# Altium schematic sheet Bank_13_15.SchDoc: Kasli-DIOT
size 420 x 297 mm; EDA_Number: ARTIQ; Projet: ARTIQ/SINARA; Author: G.Kasprowicz; CompanyName: WUT ISE; DrawnBy: F.Świtakowski; Organization: WUT ISE; Address1: PW ISE; Address2: Nowowiejska 15/19 00-665 Warsaw; Address3: gkasprow@gmail.com; DocumentNumber: 13; SheetNumber: 16; SheetTotal: 16; ModifiedBy: -; CheckedDate: -; Title2: Bank 13 15; DivGrp: WUT ISE; Designer: F.Świtakowski; ModifiedDate: -; ProjectName: Sensor Box
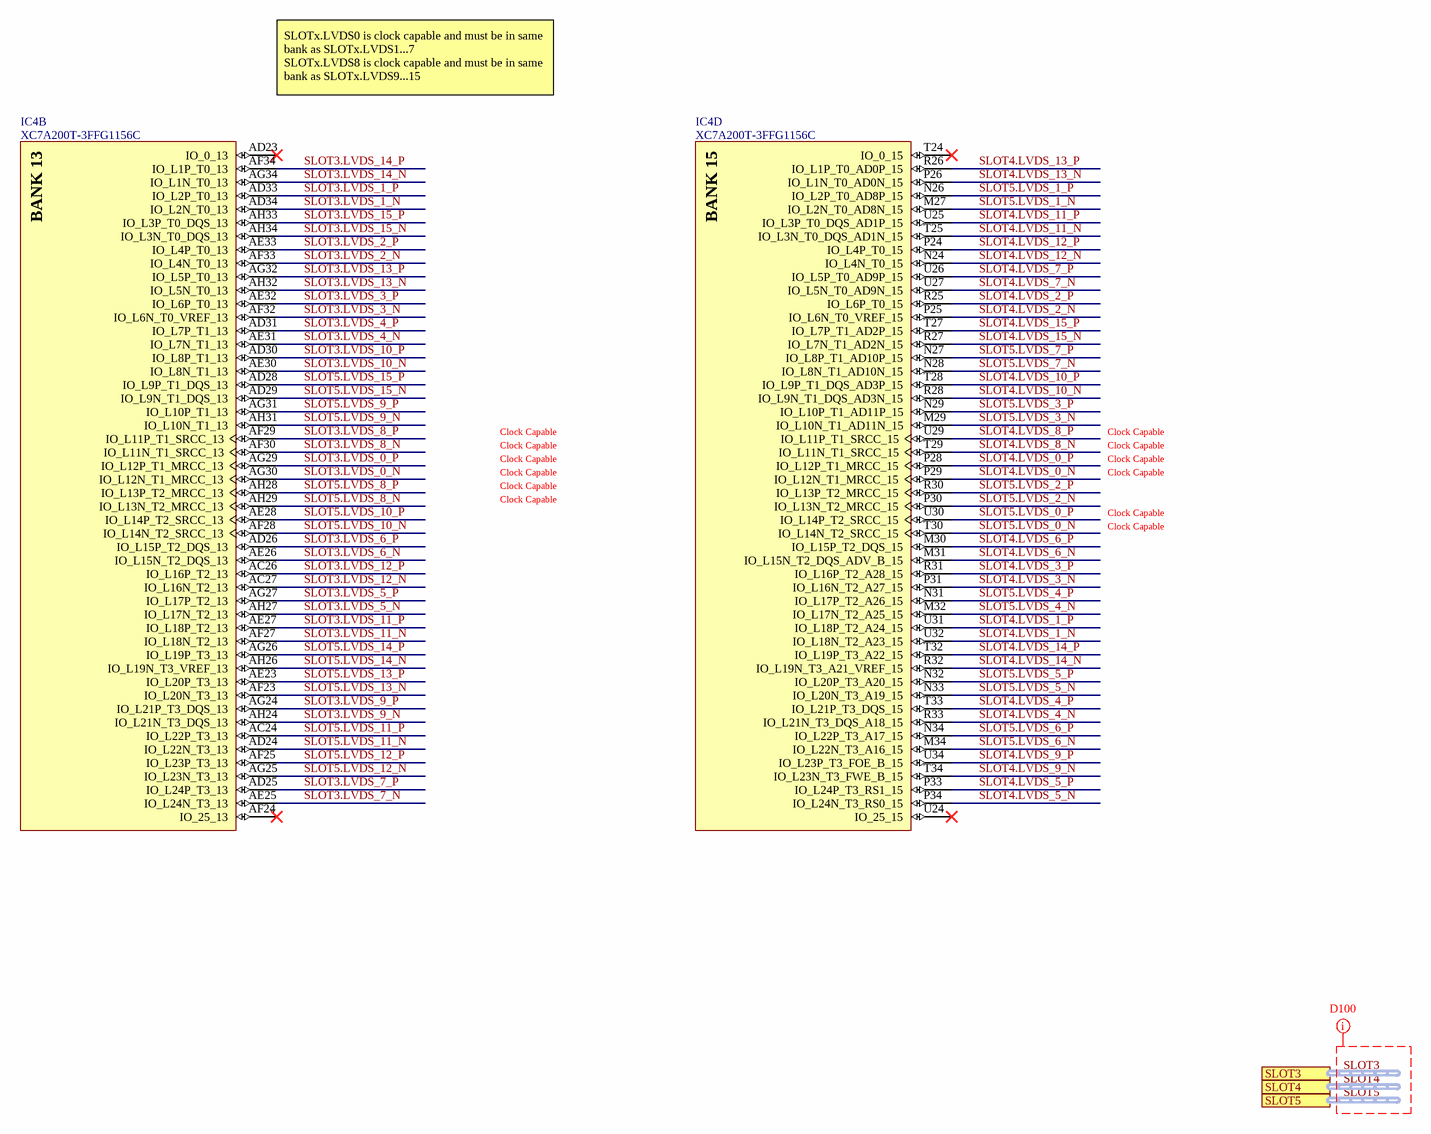
[diagram p0: Bank_13_15.SchDoc]

## Parts
IC4  XC7A200T-3FFG1156C  [BGA1156C100P34X34_3500X3500X310]  (parts B,D of 18)

## Ports
SLOT3 (harness SLOT), SLOT4 (harness SLOT), SLOT5 (harness SLOT)

## Nets
SLOT3.LVDS_0_N: IC4.AG30(IO_L12N_T1_MRCC_13)
SLOT3.LVDS_0_P: IC4.AG29(IO_L12P_T1_MRCC_13)
SLOT3.LVDS_1_N: IC4.AD34(IO_L2N_T0_13)
SLOT3.LVDS_1_P: IC4.AD33(IO_L2P_T0_13)
SLOT3.LVDS_2_N: IC4.AF33(IO_L4N_T0_13)
SLOT3.LVDS_2_P: IC4.AE33(IO_L4P_T0_13)
SLOT3.LVDS_3_N: IC4.AF32(IO_L6N_T0_VREF_13)
SLOT3.LVDS_3_P: IC4.AE32(IO_L6P_T0_13)
SLOT3.LVDS_4_N: IC4.AE31(IO_L7N_T1_13)
SLOT3.LVDS_4_P: IC4.AD31(IO_L7P_T1_13)
SLOT3.LVDS_5_N: IC4.AH27(IO_L17N_T2_13)
SLOT3.LVDS_5_P: IC4.AG27(IO_L17P_T2_13)
SLOT3.LVDS_6_N: IC4.AE26(IO_L15N_T2_DQS_13)
SLOT3.LVDS_6_P: IC4.AD26(IO_L15P_T2_DQS_13)
SLOT3.LVDS_7_N: IC4.AE25(IO_L24N_T3_13)
SLOT3.LVDS_7_P: IC4.AD25(IO_L24P_T3_13)
SLOT3.LVDS_8_N: IC4.AF30(IO_L11N_T1_SRCC_13)
SLOT3.LVDS_8_P: IC4.AF29(IO_L11P_T1_SRCC_13)
SLOT3.LVDS_9_N: IC4.AH24(IO_L21N_T3_DQS_13)
SLOT3.LVDS_9_P: IC4.AG24(IO_L21P_T3_DQS_13)
SLOT3.LVDS_10_N: IC4.AE30(IO_L8N_T1_13)
SLOT3.LVDS_10_P: IC4.AD30(IO_L8P_T1_13)
SLOT3.LVDS_11_N: IC4.AF27(IO_L18N_T2_13)
SLOT3.LVDS_11_P: IC4.AE27(IO_L18P_T2_13)
SLOT3.LVDS_12_N: IC4.AC27(IO_L16N_T2_13)
SLOT3.LVDS_12_P: IC4.AC26(IO_L16P_T2_13)
SLOT3.LVDS_13_N: IC4.AH32(IO_L5N_T0_13)
SLOT3.LVDS_13_P: IC4.AG32(IO_L5P_T0_13)
SLOT3.LVDS_14_N: IC4.AG34(IO_L1N_T0_13)
SLOT3.LVDS_14_P: IC4.AF34(IO_L1P_T0_13)
SLOT3.LVDS_15_N: IC4.AH34(IO_L3N_T0_DQS_13)
SLOT3.LVDS_15_P: IC4.AH33(IO_L3P_T0_DQS_13)
SLOT4.LVDS_0_N: IC4.P29(IO_L12N_T1_MRCC_15)
SLOT4.LVDS_0_P: IC4.P28(IO_L12P_T1_MRCC_15)
SLOT4.LVDS_1_N: IC4.U32(IO_L18N_T2_A23_15)
SLOT4.LVDS_1_P: IC4.U31(IO_L18P_T2_A24_15)
SLOT4.LVDS_2_N: IC4.P25(IO_L6N_T0_VREF_15)
SLOT4.LVDS_2_P: IC4.R25(IO_L6P_T0_15)
SLOT4.LVDS_3_N: IC4.P31(IO_L16N_T2_A27_15)
SLOT4.LVDS_3_P: IC4.R31(IO_L16P_T2_A28_15)
SLOT4.LVDS_4_N: IC4.R33(IO_L21N_T3_DQS_A18_15)
SLOT4.LVDS_4_P: IC4.T33(IO_L21P_T3_DQS_15)
SLOT4.LVDS_5_N: IC4.P34(IO_L24N_T3_RS0_15)
SLOT4.LVDS_5_P: IC4.P33(IO_L24P_T3_RS1_15)
SLOT4.LVDS_6_N: IC4.M31(IO_L15N_T2_DQS_ADV_B_15)
SLOT4.LVDS_6_P: IC4.M30(IO_L15P_T2_DQS_15)
SLOT4.LVDS_7_N: IC4.U27(IO_L5N_T0_AD9N_15)
SLOT4.LVDS_7_P: IC4.U26(IO_L5P_T0_AD9P_15)
SLOT4.LVDS_8_N: IC4.T29(IO_L11N_T1_SRCC_15)
SLOT4.LVDS_8_P: IC4.U29(IO_L11P_T1_SRCC_15)
SLOT4.LVDS_9_N: IC4.T34(IO_L23N_T3_FWE_B_15)
SLOT4.LVDS_9_P: IC4.U34(IO_L23P_T3_FOE_B_15)
SLOT4.LVDS_10_N: IC4.R28(IO_L9N_T1_DQS_AD3N_15)
SLOT4.LVDS_10_P: IC4.T28(IO_L9P_T1_DQS_AD3P_15)
SLOT4.LVDS_11_N: IC4.T25(IO_L3N_T0_DQS_AD1N_15)
SLOT4.LVDS_11_P: IC4.U25(IO_L3P_T0_DQS_AD1P_15)
SLOT4.LVDS_12_N: IC4.N24(IO_L4N_T0_15)
SLOT4.LVDS_12_P: IC4.P24(IO_L4P_T0_15)
SLOT4.LVDS_13_N: IC4.P26(IO_L1N_T0_AD0N_15)
SLOT4.LVDS_13_P: IC4.R26(IO_L1P_T0_AD0P_15)
SLOT4.LVDS_14_N: IC4.R32(IO_L19N_T3_A21_VREF_15)
SLOT4.LVDS_14_P: IC4.T32(IO_L19P_T3_A22_15)
SLOT4.LVDS_15_N: IC4.R27(IO_L7N_T1_AD2N_15)
SLOT4.LVDS_15_P: IC4.T27(IO_L7P_T1_AD2P_15)
SLOT5.LVDS_0_N: IC4.T30(IO_L14N_T2_SRCC_15)
SLOT5.LVDS_0_P: IC4.U30(IO_L14P_T2_SRCC_15)
SLOT5.LVDS_1_N: IC4.M27(IO_L2N_T0_AD8N_15)
SLOT5.LVDS_1_P: IC4.N26(IO_L2P_T0_AD8P_15)
SLOT5.LVDS_2_N: IC4.P30(IO_L13N_T2_MRCC_15)
SLOT5.LVDS_2_P: IC4.R30(IO_L13P_T2_MRCC_15)
SLOT5.LVDS_3_N: IC4.M29(IO_L10N_T1_AD11N_15)
SLOT5.LVDS_3_P: IC4.N29(IO_L10P_T1_AD11P_15)
SLOT5.LVDS_4_N: IC4.M32(IO_L17N_T2_A25_15)
SLOT5.LVDS_4_P: IC4.N31(IO_L17P_T2_A26_15)
SLOT5.LVDS_5_N: IC4.N33(IO_L20N_T3_A19_15)
SLOT5.LVDS_5_P: IC4.N32(IO_L20P_T3_A20_15)
SLOT5.LVDS_6_N: IC4.M34(IO_L22N_T3_A16_15)
SLOT5.LVDS_6_P: IC4.N34(IO_L22P_T3_A17_15)
SLOT5.LVDS_7_N: IC4.N28(IO_L8N_T1_AD10N_15)
SLOT5.LVDS_7_P: IC4.N27(IO_L8P_T1_AD10P_15)
SLOT5.LVDS_8_N: IC4.AH29(IO_L13N_T2_MRCC_13)
SLOT5.LVDS_8_P: IC4.AH28(IO_L13P_T2_MRCC_13)
SLOT5.LVDS_9_N: IC4.AH31(IO_L10N_T1_13)
SLOT5.LVDS_9_P: IC4.AG31(IO_L10P_T1_13)
SLOT5.LVDS_10_N: IC4.AF28(IO_L14N_T2_SRCC_13)
SLOT5.LVDS_10_P: IC4.AE28(IO_L14P_T2_SRCC_13)
SLOT5.LVDS_11_N: IC4.AD24(IO_L22N_T3_13)
SLOT5.LVDS_11_P: IC4.AC24(IO_L22P_T3_13)
SLOT5.LVDS_12_N: IC4.AG25(IO_L23N_T3_13)
SLOT5.LVDS_12_P: IC4.AF25(IO_L23P_T3_13)
SLOT5.LVDS_13_N: IC4.AF23(IO_L20N_T3_13)
SLOT5.LVDS_13_P: IC4.AE23(IO_L20P_T3_13)
SLOT5.LVDS_14_N: IC4.AH26(IO_L19N_T3_VREF_13)
SLOT5.LVDS_14_P: IC4.AG26(IO_L19P_T3_13)
SLOT5.LVDS_15_N: IC4.AD29(IO_L9N_T1_DQS_13)
SLOT5.LVDS_15_P: IC4.AD28(IO_L9P_T1_DQS_13)

Not connected (* = marked no-connect by the designer): IC4 AD23(IO_0_13)* AF24(IO_25_13)* T24(IO_0_15)* U24(IO_25_15)*

## Buses and harness runs
harness SLOT3 = port SLOT3
harness SLOT4 = port SLOT4
harness SLOT5 = port SLOT5

## Layout directives
net class D100: SLOT3, SLOT4, SLOT5

## Notes on the sheet
- SLOTx.LVDS0 is clock capable and must be in same bank as SLOTx.LVDS1...7
  SLOTx.LVDS8 is clock capable and must be in same bank as SLOTx.LVDS9...15
- Clock Capable
- Project/Equipment
- Document
- Designer
- Drawn by
- Check.by
- Copyright WUT ISE 2024.
  This documentation describes Open Hardware and is licensed under the CERN OHL-W v.2.0. You may redistribute and modify this documentation under the terms of the CERN OHL-W v.2.0. (http://ohwr.org/CERNOHL). This documentation is distributed WITHOUT ANY EXPRESS OR IMPLIED WARRANTY, INCLUDING OF MERCHANTABILITY, SATISFACTORY QUALITY AND FITNESS FOR A PARTICULAR PURPOSE. Please see the CERN OHL v.2.0 for applicable conditions.
- Contact
- File
- Last Mod.
- Print Date
- Sheet
- Size
- A3
- of
- Rev
- (in symbol XC7A200T-3FFG1156C, part B) BANK 13
- (in symbol XC7A200T-3FFG1156C, part D) BANK 15

## Library data of the parts
IC4 = XC7A200T-3FFG1156C: Artix-7 FPGA, 500 User I/Os, 16 GTP, 1156-Ball BGA, , Speed Grade 3, Commercial Grade, Pb-Free; Part Description: Artix-7 FPGA, 500 User I/Os, 16 GTP, 1156-Ball BGA, Speed Grade 3, Commercial Grade, Pb-Free; Manufacturer: XILINX; PressFit: No; Bonding: No; Part Number: XC7A200T-3FFG1156C; Component Kind: Standard; Component Type: Standard; Device: XC7A200T-3FFG1156C; PackageDescription: BGA, 1.00mm Pitch, Square; 1156 Pin, 34 Columns X 34 Rows, Body 35.00mm X 35.0mm X 3.10mm H, IPC Medium Density; Manufacturer Part Number: XC7A200T-3FFG1156C; Pin Count: 1156; Case: BGA1156; Mounted: Yes; Socket: No; SMD: Yes; Sense: No; ComponentHeight: 3.1mm; HelpURL: \\cern.ch\dfs\Applications\Altium\Datasheets\XC7A200T-3FFG1156C.pdf; ComponentLink1URL: \\cern.ch\dfs\Applications\Altium\Datasheets\XC7A200T-3FFG1156C_Package.pdf; ComponentLink1Description: Package; ComponentLink2URL: \\cern.ch\dfs\Applications\Altium\Datasheets\XC7A200T-3FFG1156C_Pinout.txt; ComponentLink2Description: Pinout; Author: CERN DEM JLC; CreateDate: 07.11.2016; LatestRevisionDate: 07.11.2016